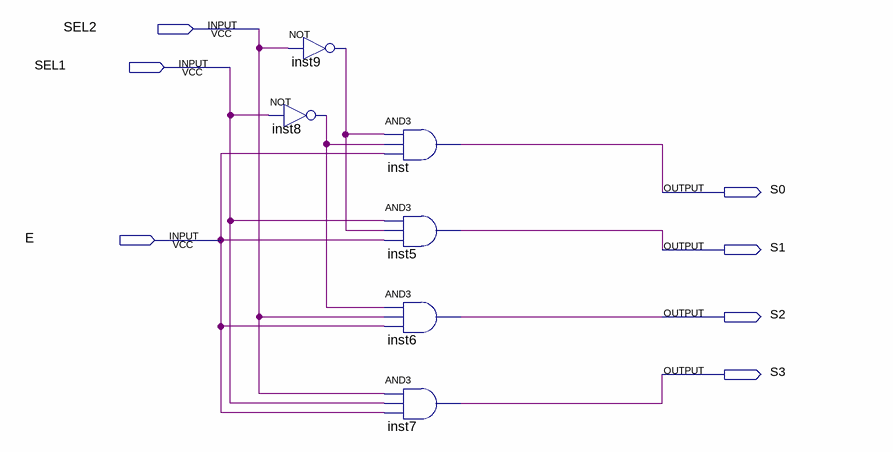
[diagram p0: schematic sheet]
// Quartus schematic mux_4x1_esq.bdf as structural Verilog: 6 symbols, 7 pins
module mux_4x1_esq (
  input  SEL2,
  input  SEL1,
  input  E,
  output S0,
  output S1,
  output S2,
  output S3
);

  wire inst8_out, inst9_out;

  not inst9 (inst9_out, SEL2);
  not inst8 (inst8_out, SEL1);
  and inst (S0, inst9_out, inst8_out, E);
  and inst5 (S1, SEL1, inst9_out, E);
  and inst6 (S2, inst8_out, SEL2, E);
  and inst7 (S3, SEL2, SEL1, E);
endmodule
